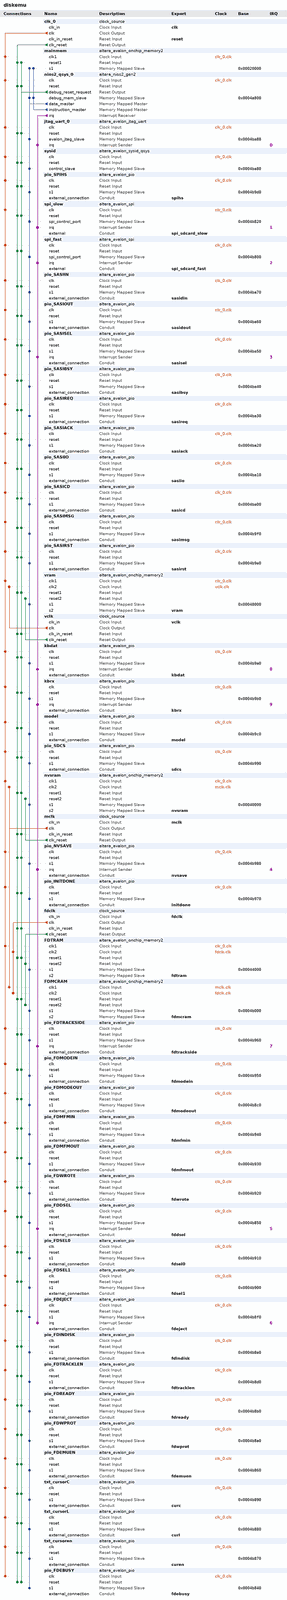
[diagram p0: system contents, whole]
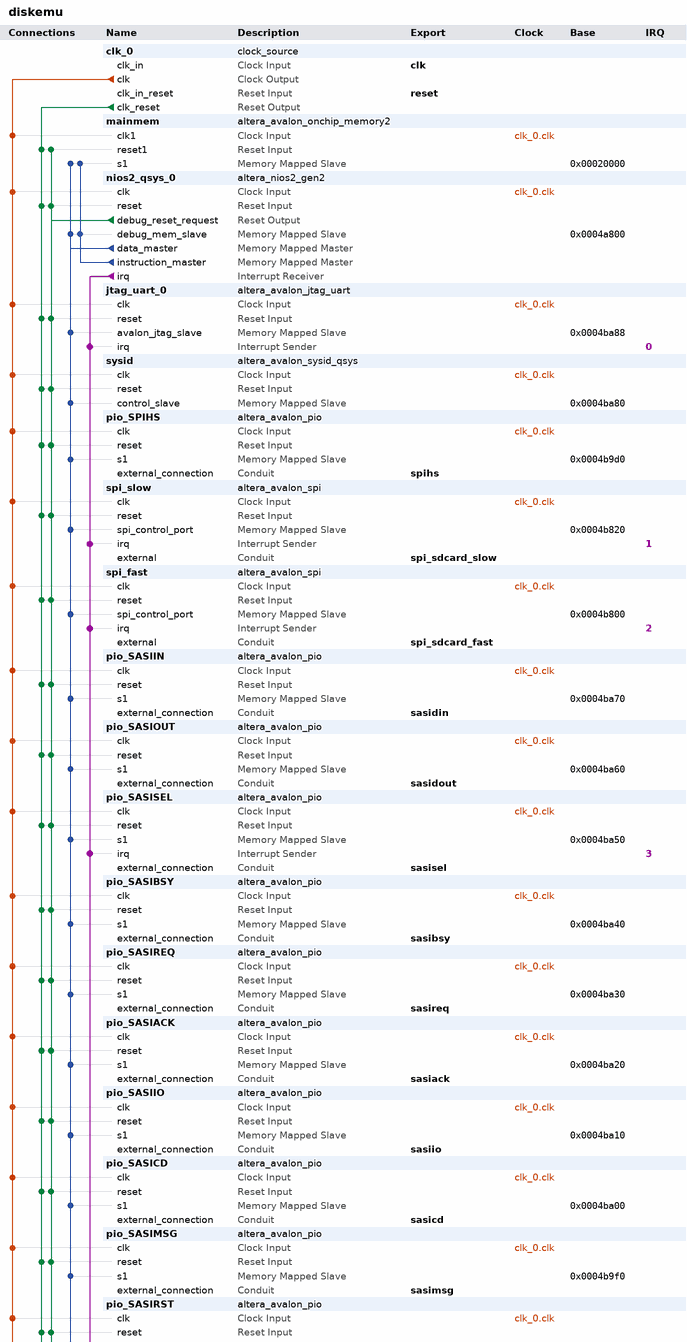
[diagram p1: system contents, upper part]
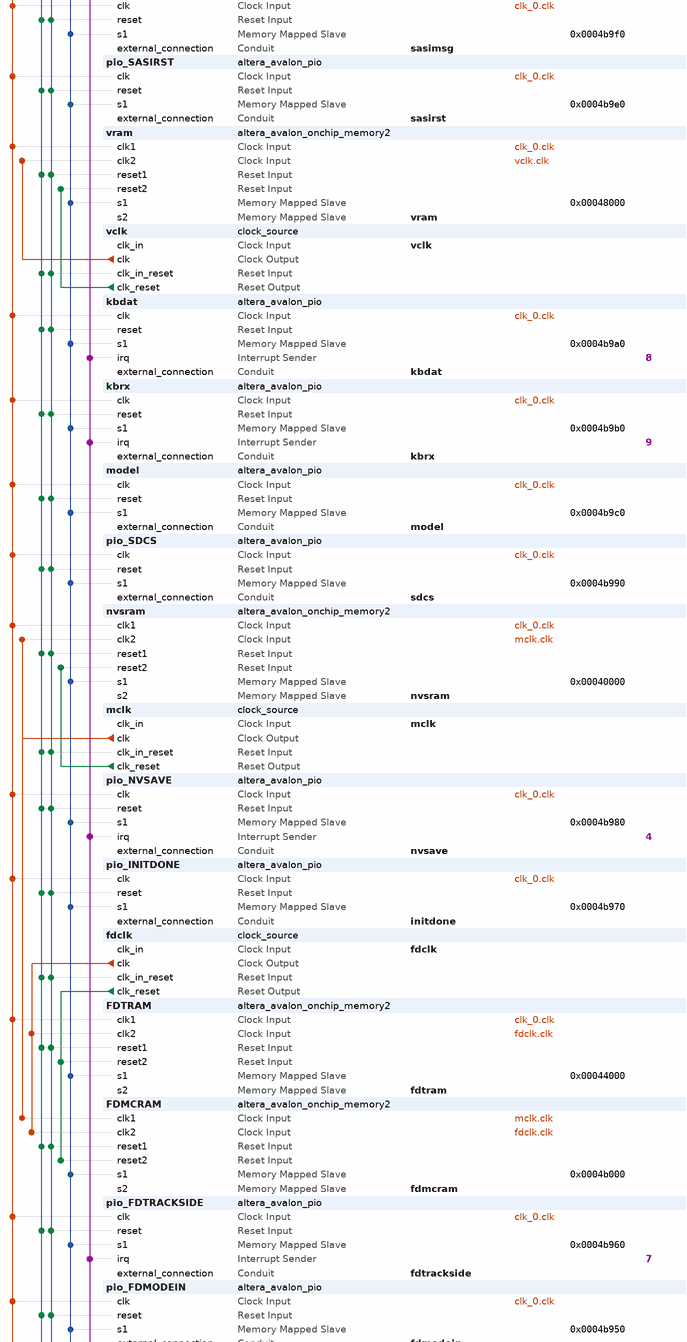
[diagram p2: system contents, middle part]
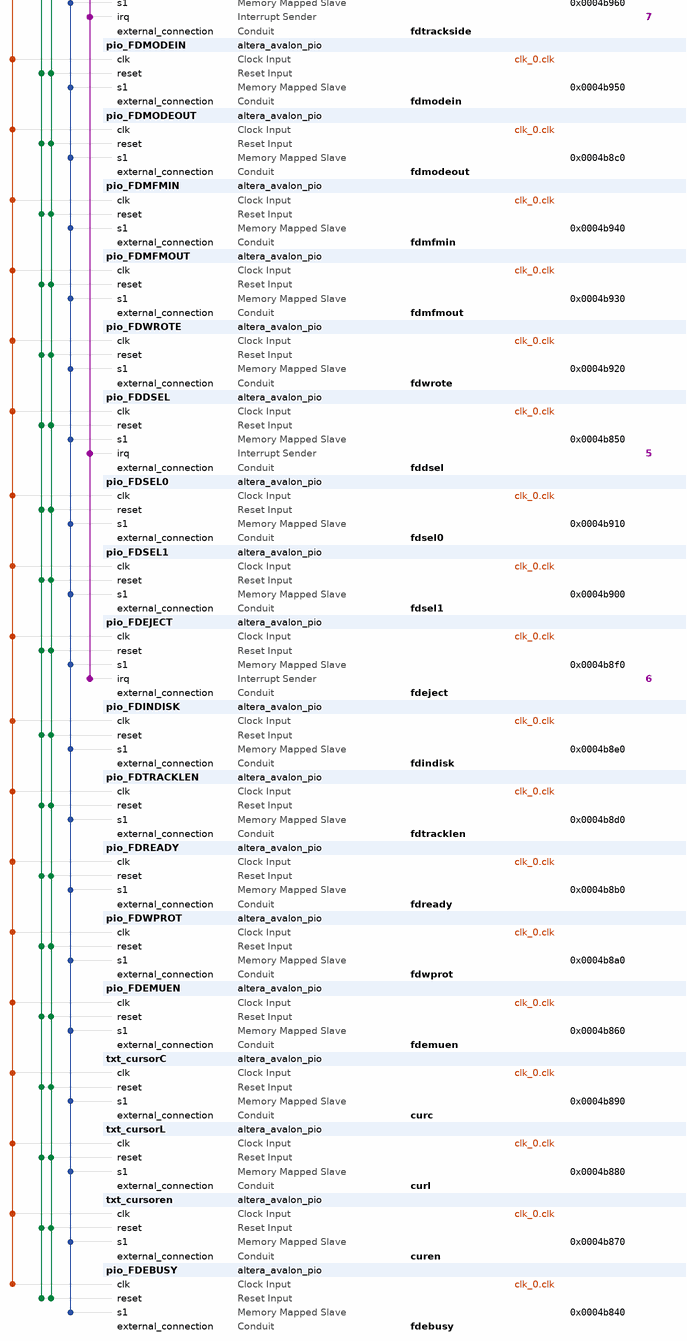
[diagram p3: system contents, lower part]
# Platform Designer (Qsys) system diskemu, Cyclone V 5CSEBA6U23I7
# Parameters at their usual value, and those the tool derives, are not listed.
package require -exact qsys 17.0
create_system diskemu
set_project_property DEVICE_FAMILY {Cyclone V}
set_project_property DEVICE 5CSEBA6U23I7

add_instance clk_0 clock_source 17.0
set_instance_parameter_value clk_0 clockFrequency 80000000

add_instance mainmem altera_avalon_onchip_memory2 17.0
set_instance_parameter_value mainmem dataWidth 32
set_instance_parameter_value mainmem dualPort false
set_instance_parameter_value mainmem initMemContent true
set_instance_parameter_value mainmem initializationFileName onchip_mem.hex
set_instance_parameter_value mainmem memorySize 98304

add_instance nios2_qsys_0 altera_nios2_gen2 17.0
set_instance_parameter_value nios2_qsys_0 dcache_size 2048
set_instance_parameter_value nios2_qsys_0 exceptionSlave mainmem.s1
set_instance_parameter_value nios2_qsys_0 icache_size 4096
set_instance_parameter_value nios2_qsys_0 impl Tiny
set_instance_parameter_value nios2_qsys_0 resetSlave mainmem.s1
set_instance_parameter_value nios2_qsys_0 setting_activateTrace true

add_instance jtag_uart_0 altera_avalon_jtag_uart 17.0
set_instance_parameter_value jtag_uart_0 simInteractiveOptions NO_INTERACTIVE_WINDOWS

add_instance sysid altera_avalon_sysid_qsys 17.0
set_instance_parameter_value sysid id 0

add_instance pio_SPIHS altera_avalon_pio 17.0
set_instance_parameter_value pio_SPIHS direction Output
set_instance_parameter_value pio_SPIHS width 1

add_instance spi_slow altera_avalon_spi 17.0
set_instance_parameter_value spi_slow clockPhase 1
set_instance_parameter_value spi_slow clockPolarity 1
set_instance_parameter_value spi_slow dataWidth 8
set_instance_parameter_value spi_slow masterSPI true
set_instance_parameter_value spi_slow numberOfSlaves 1
set_instance_parameter_value spi_slow targetClockRate 128000

add_instance spi_fast altera_avalon_spi 17.0
set_instance_parameter_value spi_fast clockPhase 1
set_instance_parameter_value spi_fast clockPolarity 1
set_instance_parameter_value spi_fast dataWidth 8
set_instance_parameter_value spi_fast masterSPI true
set_instance_parameter_value spi_fast numberOfSlaves 1
set_instance_parameter_value spi_fast targetClockRate 10000000

add_instance pio_SASIIN altera_avalon_pio 17.0
set_instance_parameter_value pio_SASIIN captureEdge true
set_instance_parameter_value pio_SASIIN direction Input
set_instance_parameter_value pio_SASIIN width 8

add_instance pio_SASIOUT altera_avalon_pio 17.0
set_instance_parameter_value pio_SASIOUT direction Output
set_instance_parameter_value pio_SASIOUT width 8

add_instance pio_SASISEL altera_avalon_pio 17.0
set_instance_parameter_value pio_SASISEL captureEdge true
set_instance_parameter_value pio_SASISEL direction Input
set_instance_parameter_value pio_SASISEL generateIRQ true
set_instance_parameter_value pio_SASISEL width 1

add_instance pio_SASIBSY altera_avalon_pio 17.0
set_instance_parameter_value pio_SASIBSY direction Output
set_instance_parameter_value pio_SASIBSY width 1

add_instance pio_SASIREQ altera_avalon_pio 17.0
set_instance_parameter_value pio_SASIREQ direction Output
set_instance_parameter_value pio_SASIREQ width 1

add_instance pio_SASIACK altera_avalon_pio 17.0
set_instance_parameter_value pio_SASIACK captureEdge true
set_instance_parameter_value pio_SASIACK direction Input
set_instance_parameter_value pio_SASIACK width 1

add_instance pio_SASIIO altera_avalon_pio 17.0
set_instance_parameter_value pio_SASIIO direction Output
set_instance_parameter_value pio_SASIIO width 1

add_instance pio_SASICD altera_avalon_pio 17.0
set_instance_parameter_value pio_SASICD captureEdge true
set_instance_parameter_value pio_SASICD direction Output
set_instance_parameter_value pio_SASICD width 1

add_instance pio_SASIMSG altera_avalon_pio 17.0
set_instance_parameter_value pio_SASIMSG direction Output
set_instance_parameter_value pio_SASIMSG width 1

add_instance pio_SASIRST altera_avalon_pio 17.0
set_instance_parameter_value pio_SASIRST captureEdge true
set_instance_parameter_value pio_SASIRST direction Input
set_instance_parameter_value pio_SASIRST width 1

add_instance vram altera_avalon_onchip_memory2 17.0
set_instance_parameter_value vram dataWidth 8
set_instance_parameter_value vram dualPort true
set_instance_parameter_value vram initMemContent true
set_instance_parameter_value vram initializationFileName onchip_mem.hex
set_instance_parameter_value vram memorySize 8192

add_instance vclk clock_source 17.0
set_instance_parameter_value vclk clockFrequency 80000000

add_instance kbdat altera_avalon_pio 17.0
set_instance_parameter_value kbdat captureEdge true
set_instance_parameter_value kbdat direction Input
set_instance_parameter_value kbdat generateIRQ true
set_instance_parameter_value kbdat irqType EDGE
set_instance_parameter_value kbdat width 8

add_instance kbrx altera_avalon_pio 17.0
set_instance_parameter_value kbrx captureEdge true
set_instance_parameter_value kbrx direction Input
set_instance_parameter_value kbrx generateIRQ true
set_instance_parameter_value kbrx irqType EDGE
set_instance_parameter_value kbrx width 1

add_instance model altera_avalon_pio 17.0
set_instance_parameter_value model direction Input
set_instance_parameter_value model width 8

add_instance pio_SDCS altera_avalon_pio 17.0
set_instance_parameter_value pio_SDCS direction Output
set_instance_parameter_value pio_SDCS resetValue 1
set_instance_parameter_value pio_SDCS width 1

add_instance nvsram altera_avalon_onchip_memory2 17.0
set_instance_parameter_value nvsram dataWidth 16
set_instance_parameter_value nvsram dualPort true
set_instance_parameter_value nvsram initMemContent true
set_instance_parameter_value nvsram initializationFileName onchip_mem.hex
set_instance_parameter_value nvsram memorySize 16384

add_instance mclk clock_source 17.0
set_instance_parameter_value mclk clockFrequency 10000000

add_instance pio_NVSAVE altera_avalon_pio 17.0
set_instance_parameter_value pio_NVSAVE captureEdge true
set_instance_parameter_value pio_NVSAVE direction Input
set_instance_parameter_value pio_NVSAVE generateIRQ true
set_instance_parameter_value pio_NVSAVE irqType EDGE
set_instance_parameter_value pio_NVSAVE width 1

add_instance pio_INITDONE altera_avalon_pio 17.0
set_instance_parameter_value pio_INITDONE direction Output
set_instance_parameter_value pio_INITDONE width 1

add_instance fdclk clock_source 17.0
set_instance_parameter_value fdclk clockFrequency 40000000

add_instance FDTRAM altera_avalon_onchip_memory2 17.0
set_instance_parameter_value FDTRAM dataWidth 8
set_instance_parameter_value FDTRAM dualPort true
set_instance_parameter_value FDTRAM initMemContent true
set_instance_parameter_value FDTRAM initializationFileName onchip_mem.hex
set_instance_parameter_value FDTRAM memorySize 12500

add_instance FDMCRAM altera_avalon_onchip_memory2 17.0
set_instance_parameter_value FDMCRAM dataWidth 8
set_instance_parameter_value FDMCRAM dualPort true
set_instance_parameter_value FDMCRAM initMemContent false
set_instance_parameter_value FDMCRAM initializationFileName onchip_mem.hex
set_instance_parameter_value FDMCRAM memorySize 1792

add_instance pio_FDTRACKSIDE altera_avalon_pio 17.0
set_instance_parameter_value pio_FDTRACKSIDE captureEdge true
set_instance_parameter_value pio_FDTRACKSIDE direction Input
set_instance_parameter_value pio_FDTRACKSIDE edgeType ANY
set_instance_parameter_value pio_FDTRACKSIDE generateIRQ true
set_instance_parameter_value pio_FDTRACKSIDE irqType EDGE
set_instance_parameter_value pio_FDTRACKSIDE width 8

add_instance pio_FDMODEIN altera_avalon_pio 17.0
set_instance_parameter_value pio_FDMODEIN direction Input
set_instance_parameter_value pio_FDMODEIN width 2

add_instance pio_FDMODEOUT altera_avalon_pio 17.0
set_instance_parameter_value pio_FDMODEOUT direction Output
set_instance_parameter_value pio_FDMODEOUT width 2

add_instance pio_FDMFMIN altera_avalon_pio 17.0
set_instance_parameter_value pio_FDMFMIN direction Input
set_instance_parameter_value pio_FDMFMIN width 1

add_instance pio_FDMFMOUT altera_avalon_pio 17.0
set_instance_parameter_value pio_FDMFMOUT direction Output
set_instance_parameter_value pio_FDMFMOUT width 1

add_instance pio_FDWROTE altera_avalon_pio 17.0
set_instance_parameter_value pio_FDWROTE captureEdge true
set_instance_parameter_value pio_FDWROTE direction Input
set_instance_parameter_value pio_FDWROTE width 1

add_instance pio_FDDSEL altera_avalon_pio 17.0
set_instance_parameter_value pio_FDDSEL captureEdge true
set_instance_parameter_value pio_FDDSEL direction Input
set_instance_parameter_value pio_FDDSEL edgeType ANY
set_instance_parameter_value pio_FDDSEL generateIRQ true
set_instance_parameter_value pio_FDDSEL irqType EDGE
set_instance_parameter_value pio_FDDSEL width 4

add_instance pio_FDSEL0 altera_avalon_pio 17.0
set_instance_parameter_value pio_FDSEL0 direction Output
set_instance_parameter_value pio_FDSEL0 resetValue 1
set_instance_parameter_value pio_FDSEL0 width 4

add_instance pio_FDSEL1 altera_avalon_pio 17.0
set_instance_parameter_value pio_FDSEL1 direction Output
set_instance_parameter_value pio_FDSEL1 resetValue 2
set_instance_parameter_value pio_FDSEL1 width 4

add_instance pio_FDEJECT altera_avalon_pio 17.0
set_instance_parameter_value pio_FDEJECT captureEdge true
set_instance_parameter_value pio_FDEJECT direction Input
set_instance_parameter_value pio_FDEJECT generateIRQ true
set_instance_parameter_value pio_FDEJECT irqType EDGE
set_instance_parameter_value pio_FDEJECT width 4

add_instance pio_FDINDISK altera_avalon_pio 17.0
set_instance_parameter_value pio_FDINDISK direction Output
set_instance_parameter_value pio_FDINDISK width 4

add_instance pio_FDTRACKLEN altera_avalon_pio 17.0
set_instance_parameter_value pio_FDTRACKLEN direction Output
set_instance_parameter_value pio_FDTRACKLEN width 14

add_instance pio_FDREADY altera_avalon_pio 17.0
set_instance_parameter_value pio_FDREADY direction Output
set_instance_parameter_value pio_FDREADY width 1

add_instance pio_FDWPROT altera_avalon_pio 17.0
set_instance_parameter_value pio_FDWPROT direction Output
set_instance_parameter_value pio_FDWPROT width 1

add_instance pio_FDEMUEN altera_avalon_pio 17.0
set_instance_parameter_value pio_FDEMUEN direction Output
set_instance_parameter_value pio_FDEMUEN width 4

add_instance txt_cursorC altera_avalon_pio 17.0
set_instance_parameter_value txt_cursorC direction Output
set_instance_parameter_value txt_cursorC width 7

add_instance txt_cursorL altera_avalon_pio 17.0
set_instance_parameter_value txt_cursorL direction Output
set_instance_parameter_value txt_cursorL width 6

add_instance txt_cursoren altera_avalon_pio 17.0
set_instance_parameter_value txt_cursoren direction Output
set_instance_parameter_value txt_cursoren width 1

add_instance pio_FDEBUSY altera_avalon_pio 17.0
set_instance_parameter_value pio_FDEBUSY direction Output
set_instance_parameter_value pio_FDEBUSY width 1

# connections
add_connection clk_0.clk FDTRAM.clk1 clock
add_connection clk_0.clk jtag_uart_0.clk clock
add_connection clk_0.clk kbdat.clk clock
add_connection clk_0.clk kbrx.clk clock
add_connection clk_0.clk mainmem.clk1 clock
add_connection clk_0.clk model.clk clock
add_connection clk_0.clk nios2_qsys_0.clk clock
add_connection clk_0.clk nvsram.clk1 clock
add_connection clk_0.clk pio_FDDSEL.clk clock
add_connection clk_0.clk pio_FDEBUSY.clk clock
add_connection clk_0.clk pio_FDEJECT.clk clock
add_connection clk_0.clk pio_FDEMUEN.clk clock
add_connection clk_0.clk pio_FDINDISK.clk clock
add_connection clk_0.clk pio_FDMFMIN.clk clock
add_connection clk_0.clk pio_FDMFMOUT.clk clock
add_connection clk_0.clk pio_FDMODEIN.clk clock
add_connection clk_0.clk pio_FDMODEOUT.clk clock
add_connection clk_0.clk pio_FDREADY.clk clock
add_connection clk_0.clk pio_FDSEL0.clk clock
add_connection clk_0.clk pio_FDSEL1.clk clock
add_connection clk_0.clk pio_FDTRACKLEN.clk clock
add_connection clk_0.clk pio_FDTRACKSIDE.clk clock
add_connection clk_0.clk pio_FDWPROT.clk clock
add_connection clk_0.clk pio_FDWROTE.clk clock
add_connection clk_0.clk pio_INITDONE.clk clock
add_connection clk_0.clk pio_NVSAVE.clk clock
add_connection clk_0.clk pio_SASIACK.clk clock
add_connection clk_0.clk pio_SASIBSY.clk clock
add_connection clk_0.clk pio_SASICD.clk clock
add_connection clk_0.clk pio_SASIIN.clk clock
add_connection clk_0.clk pio_SASIIO.clk clock
add_connection clk_0.clk pio_SASIMSG.clk clock
add_connection clk_0.clk pio_SASIOUT.clk clock
add_connection clk_0.clk pio_SASIREQ.clk clock
add_connection clk_0.clk pio_SASIRST.clk clock
add_connection clk_0.clk pio_SASISEL.clk clock
add_connection clk_0.clk pio_SDCS.clk clock
add_connection clk_0.clk pio_SPIHS.clk clock
add_connection clk_0.clk spi_fast.clk clock
add_connection clk_0.clk spi_slow.clk clock
add_connection clk_0.clk sysid.clk clock
add_connection clk_0.clk txt_cursorC.clk clock
add_connection clk_0.clk txt_cursoren.clk clock
add_connection clk_0.clk txt_cursorL.clk clock
add_connection clk_0.clk vram.clk1 clock
add_connection fdclk.clk FDMCRAM.clk2 clock
add_connection fdclk.clk FDTRAM.clk2 clock
add_connection mclk.clk FDMCRAM.clk1 clock
add_connection mclk.clk nvsram.clk2 clock
add_connection vclk.clk vram.clk2 clock
add_connection clk_0.clk_reset fdclk.clk_in_reset reset
add_connection clk_0.clk_reset FDMCRAM.reset1 reset
add_connection clk_0.clk_reset FDTRAM.reset1 reset
add_connection clk_0.clk_reset jtag_uart_0.reset reset
add_connection clk_0.clk_reset kbdat.reset reset
add_connection clk_0.clk_reset kbrx.reset reset
add_connection clk_0.clk_reset mainmem.reset1 reset
add_connection clk_0.clk_reset mclk.clk_in_reset reset
add_connection clk_0.clk_reset model.reset reset
add_connection clk_0.clk_reset nios2_qsys_0.reset reset
add_connection clk_0.clk_reset nvsram.reset1 reset
add_connection clk_0.clk_reset pio_FDDSEL.reset reset
add_connection clk_0.clk_reset pio_FDEBUSY.reset reset
add_connection clk_0.clk_reset pio_FDEJECT.reset reset
add_connection clk_0.clk_reset pio_FDEMUEN.reset reset
add_connection clk_0.clk_reset pio_FDINDISK.reset reset
add_connection clk_0.clk_reset pio_FDMFMIN.reset reset
add_connection clk_0.clk_reset pio_FDMFMOUT.reset reset
add_connection clk_0.clk_reset pio_FDMODEIN.reset reset
add_connection clk_0.clk_reset pio_FDMODEOUT.reset reset
add_connection clk_0.clk_reset pio_FDREADY.reset reset
add_connection clk_0.clk_reset pio_FDSEL0.reset reset
add_connection clk_0.clk_reset pio_FDSEL1.reset reset
add_connection clk_0.clk_reset pio_FDTRACKLEN.reset reset
add_connection clk_0.clk_reset pio_FDTRACKSIDE.reset reset
add_connection clk_0.clk_reset pio_FDWPROT.reset reset
add_connection clk_0.clk_reset pio_FDWROTE.reset reset
add_connection clk_0.clk_reset pio_INITDONE.reset reset
add_connection clk_0.clk_reset pio_NVSAVE.reset reset
add_connection clk_0.clk_reset pio_SASIACK.reset reset
add_connection clk_0.clk_reset pio_SASIBSY.reset reset
add_connection clk_0.clk_reset pio_SASICD.reset reset
add_connection clk_0.clk_reset pio_SASIIN.reset reset
add_connection clk_0.clk_reset pio_SASIIO.reset reset
add_connection clk_0.clk_reset pio_SASIMSG.reset reset
add_connection clk_0.clk_reset pio_SASIOUT.reset reset
add_connection clk_0.clk_reset pio_SASIREQ.reset reset
add_connection clk_0.clk_reset pio_SASIRST.reset reset
add_connection clk_0.clk_reset pio_SASISEL.reset reset
add_connection clk_0.clk_reset pio_SDCS.reset reset
add_connection clk_0.clk_reset pio_SPIHS.reset reset
add_connection clk_0.clk_reset spi_fast.reset reset
add_connection clk_0.clk_reset spi_slow.reset reset
add_connection clk_0.clk_reset sysid.reset reset
add_connection clk_0.clk_reset txt_cursorC.reset reset
add_connection clk_0.clk_reset txt_cursoren.reset reset
add_connection clk_0.clk_reset txt_cursorL.reset reset
add_connection clk_0.clk_reset vclk.clk_in_reset reset
add_connection clk_0.clk_reset vram.reset1 reset
add_connection fdclk.clk_reset FDMCRAM.reset2 reset
add_connection fdclk.clk_reset FDTRAM.reset2 reset
add_connection mclk.clk_reset nvsram.reset2 reset
add_connection nios2_qsys_0.debug_reset_request fdclk.clk_in_reset reset
add_connection nios2_qsys_0.debug_reset_request FDMCRAM.reset1 reset
add_connection nios2_qsys_0.debug_reset_request FDTRAM.reset1 reset
add_connection nios2_qsys_0.debug_reset_request jtag_uart_0.reset reset
add_connection nios2_qsys_0.debug_reset_request kbdat.reset reset
add_connection nios2_qsys_0.debug_reset_request kbrx.reset reset
add_connection nios2_qsys_0.debug_reset_request mainmem.reset1 reset
add_connection nios2_qsys_0.debug_reset_request mclk.clk_in_reset reset
add_connection nios2_qsys_0.debug_reset_request model.reset reset
add_connection nios2_qsys_0.debug_reset_request nios2_qsys_0.reset reset
add_connection nios2_qsys_0.debug_reset_request nvsram.reset1 reset
add_connection nios2_qsys_0.debug_reset_request pio_FDDSEL.reset reset
add_connection nios2_qsys_0.debug_reset_request pio_FDEBUSY.reset reset
add_connection nios2_qsys_0.debug_reset_request pio_FDEJECT.reset reset
add_connection nios2_qsys_0.debug_reset_request pio_FDEMUEN.reset reset
add_connection nios2_qsys_0.debug_reset_request pio_FDINDISK.reset reset
add_connection nios2_qsys_0.debug_reset_request pio_FDMFMIN.reset reset
add_connection nios2_qsys_0.debug_reset_request pio_FDMFMOUT.reset reset
add_connection nios2_qsys_0.debug_reset_request pio_FDMODEIN.reset reset
add_connection nios2_qsys_0.debug_reset_request pio_FDMODEOUT.reset reset
add_connection nios2_qsys_0.debug_reset_request pio_FDREADY.reset reset
add_connection nios2_qsys_0.debug_reset_request pio_FDSEL0.reset reset
add_connection nios2_qsys_0.debug_reset_request pio_FDSEL1.reset reset
add_connection nios2_qsys_0.debug_reset_request pio_FDTRACKLEN.reset reset
add_connection nios2_qsys_0.debug_reset_request pio_FDTRACKSIDE.reset reset
add_connection nios2_qsys_0.debug_reset_request pio_FDWPROT.reset reset
add_connection nios2_qsys_0.debug_reset_request pio_FDWROTE.reset reset
add_connection nios2_qsys_0.debug_reset_request pio_INITDONE.reset reset
add_connection nios2_qsys_0.debug_reset_request pio_NVSAVE.reset reset
add_connection nios2_qsys_0.debug_reset_request pio_SASIACK.reset reset
add_connection nios2_qsys_0.debug_reset_request pio_SASIBSY.reset reset
add_connection nios2_qsys_0.debug_reset_request pio_SASICD.reset reset
add_connection nios2_qsys_0.debug_reset_request pio_SASIIN.reset reset
add_connection nios2_qsys_0.debug_reset_request pio_SASIIO.reset reset
add_connection nios2_qsys_0.debug_reset_request pio_SASIMSG.reset reset
add_connection nios2_qsys_0.debug_reset_request pio_SASIOUT.reset reset
add_connection nios2_qsys_0.debug_reset_request pio_SASIREQ.reset reset
add_connection nios2_qsys_0.debug_reset_request pio_SASIRST.reset reset
add_connection nios2_qsys_0.debug_reset_request pio_SASISEL.reset reset
add_connection nios2_qsys_0.debug_reset_request pio_SDCS.reset reset
add_connection nios2_qsys_0.debug_reset_request pio_SPIHS.reset reset
add_connection nios2_qsys_0.debug_reset_request spi_fast.reset reset
add_connection nios2_qsys_0.debug_reset_request spi_slow.reset reset
add_connection nios2_qsys_0.debug_reset_request sysid.reset reset
add_connection nios2_qsys_0.debug_reset_request txt_cursorC.reset reset
add_connection nios2_qsys_0.debug_reset_request txt_cursoren.reset reset
add_connection nios2_qsys_0.debug_reset_request txt_cursorL.reset reset
add_connection nios2_qsys_0.debug_reset_request vclk.clk_in_reset reset
add_connection nios2_qsys_0.debug_reset_request vram.reset1 reset
add_connection vclk.clk_reset vram.reset2 reset
add_connection nios2_qsys_0.data_master FDMCRAM.s1 avalon
set_connection_parameter_value nios2_qsys_0.data_master/FDMCRAM.s1 baseAddress 0x0004b000
add_connection nios2_qsys_0.data_master FDTRAM.s1 avalon
set_connection_parameter_value nios2_qsys_0.data_master/FDTRAM.s1 baseAddress 0x00044000
add_connection nios2_qsys_0.data_master jtag_uart_0.avalon_jtag_slave avalon
set_connection_parameter_value nios2_qsys_0.data_master/jtag_uart_0.avalon_jtag_slave baseAddress 0x0004ba88
add_connection nios2_qsys_0.data_master kbdat.s1 avalon
set_connection_parameter_value nios2_qsys_0.data_master/kbdat.s1 baseAddress 0x0004b9a0
add_connection nios2_qsys_0.data_master kbrx.s1 avalon
set_connection_parameter_value nios2_qsys_0.data_master/kbrx.s1 baseAddress 0x0004b9b0
add_connection nios2_qsys_0.data_master mainmem.s1 avalon
set_connection_parameter_value nios2_qsys_0.data_master/mainmem.s1 baseAddress 0x00020000
add_connection nios2_qsys_0.data_master model.s1 avalon
set_connection_parameter_value nios2_qsys_0.data_master/model.s1 baseAddress 0x0004b9c0
add_connection nios2_qsys_0.data_master nios2_qsys_0.debug_mem_slave avalon
set_connection_parameter_value nios2_qsys_0.data_master/nios2_qsys_0.debug_mem_slave baseAddress 0x0004a800
add_connection nios2_qsys_0.data_master nvsram.s1 avalon
set_connection_parameter_value nios2_qsys_0.data_master/nvsram.s1 baseAddress 0x00040000
add_connection nios2_qsys_0.data_master pio_FDDSEL.s1 avalon
set_connection_parameter_value nios2_qsys_0.data_master/pio_FDDSEL.s1 baseAddress 0x0004b850
add_connection nios2_qsys_0.data_master pio_FDEBUSY.s1 avalon
set_connection_parameter_value nios2_qsys_0.data_master/pio_FDEBUSY.s1 baseAddress 0x0004b840
add_connection nios2_qsys_0.data_master pio_FDEJECT.s1 avalon
set_connection_parameter_value nios2_qsys_0.data_master/pio_FDEJECT.s1 baseAddress 0x0004b8f0
add_connection nios2_qsys_0.data_master pio_FDEMUEN.s1 avalon
set_connection_parameter_value nios2_qsys_0.data_master/pio_FDEMUEN.s1 baseAddress 0x0004b860
add_connection nios2_qsys_0.data_master pio_FDINDISK.s1 avalon
set_connection_parameter_value nios2_qsys_0.data_master/pio_FDINDISK.s1 baseAddress 0x0004b8e0
add_connection nios2_qsys_0.data_master pio_FDMFMIN.s1 avalon
set_connection_parameter_value nios2_qsys_0.data_master/pio_FDMFMIN.s1 baseAddress 0x0004b940
add_connection nios2_qsys_0.data_master pio_FDMFMOUT.s1 avalon
set_connection_parameter_value nios2_qsys_0.data_master/pio_FDMFMOUT.s1 baseAddress 0x0004b930
add_connection nios2_qsys_0.data_master pio_FDMODEIN.s1 avalon
set_connection_parameter_value nios2_qsys_0.data_master/pio_FDMODEIN.s1 baseAddress 0x0004b950
add_connection nios2_qsys_0.data_master pio_FDMODEOUT.s1 avalon
set_connection_parameter_value nios2_qsys_0.data_master/pio_FDMODEOUT.s1 baseAddress 0x0004b8c0
add_connection nios2_qsys_0.data_master pio_FDREADY.s1 avalon
set_connection_parameter_value nios2_qsys_0.data_master/pio_FDREADY.s1 baseAddress 0x0004b8b0
add_connection nios2_qsys_0.data_master pio_FDSEL0.s1 avalon
set_connection_parameter_value nios2_qsys_0.data_master/pio_FDSEL0.s1 baseAddress 0x0004b910
add_connection nios2_qsys_0.data_master pio_FDSEL1.s1 avalon
set_connection_parameter_value nios2_qsys_0.data_master/pio_FDSEL1.s1 baseAddress 0x0004b900
add_connection nios2_qsys_0.data_master pio_FDTRACKLEN.s1 avalon
set_connection_parameter_value nios2_qsys_0.data_master/pio_FDTRACKLEN.s1 baseAddress 0x0004b8d0
add_connection nios2_qsys_0.data_master pio_FDTRACKSIDE.s1 avalon
set_connection_parameter_value nios2_qsys_0.data_master/pio_FDTRACKSIDE.s1 baseAddress 0x0004b960
add_connection nios2_qsys_0.data_master pio_FDWPROT.s1 avalon
set_connection_parameter_value nios2_qsys_0.data_master/pio_FDWPROT.s1 baseAddress 0x0004b8a0
add_connection nios2_qsys_0.data_master pio_FDWROTE.s1 avalon
set_connection_parameter_value nios2_qsys_0.data_master/pio_FDWROTE.s1 baseAddress 0x0004b920
add_connection nios2_qsys_0.data_master pio_INITDONE.s1 avalon
set_connection_parameter_value nios2_qsys_0.data_master/pio_INITDONE.s1 baseAddress 0x0004b970
add_connection nios2_qsys_0.data_master pio_NVSAVE.s1 avalon
set_connection_parameter_value nios2_qsys_0.data_master/pio_NVSAVE.s1 baseAddress 0x0004b980
add_connection nios2_qsys_0.data_master pio_SASIACK.s1 avalon
set_connection_parameter_value nios2_qsys_0.data_master/pio_SASIACK.s1 baseAddress 0x0004ba20
add_connection nios2_qsys_0.data_master pio_SASIBSY.s1 avalon
set_connection_parameter_value nios2_qsys_0.data_master/pio_SASIBSY.s1 baseAddress 0x0004ba40
add_connection nios2_qsys_0.data_master pio_SASICD.s1 avalon
set_connection_parameter_value nios2_qsys_0.data_master/pio_SASICD.s1 baseAddress 0x0004ba00
add_connection nios2_qsys_0.data_master pio_SASIIN.s1 avalon
set_connection_parameter_value nios2_qsys_0.data_master/pio_SASIIN.s1 baseAddress 0x0004ba70
add_connection nios2_qsys_0.data_master pio_SASIIO.s1 avalon
set_connection_parameter_value nios2_qsys_0.data_master/pio_SASIIO.s1 baseAddress 0x0004ba10
add_connection nios2_qsys_0.data_master pio_SASIMSG.s1 avalon
set_connection_parameter_value nios2_qsys_0.data_master/pio_SASIMSG.s1 baseAddress 0x0004b9f0
add_connection nios2_qsys_0.data_master pio_SASIOUT.s1 avalon
set_connection_parameter_value nios2_qsys_0.data_master/pio_SASIOUT.s1 baseAddress 0x0004ba60
add_connection nios2_qsys_0.data_master pio_SASIREQ.s1 avalon
set_connection_parameter_value nios2_qsys_0.data_master/pio_SASIREQ.s1 baseAddress 0x0004ba30
add_connection nios2_qsys_0.data_master pio_SASIRST.s1 avalon
set_connection_parameter_value nios2_qsys_0.data_master/pio_SASIRST.s1 baseAddress 0x0004b9e0
add_connection nios2_qsys_0.data_master pio_SASISEL.s1 avalon
set_connection_parameter_value nios2_qsys_0.data_master/pio_SASISEL.s1 baseAddress 0x0004ba50
add_connection nios2_qsys_0.data_master pio_SDCS.s1 avalon
set_connection_parameter_value nios2_qsys_0.data_master/pio_SDCS.s1 baseAddress 0x0004b990
add_connection nios2_qsys_0.data_master pio_SPIHS.s1 avalon
set_connection_parameter_value nios2_qsys_0.data_master/pio_SPIHS.s1 baseAddress 0x0004b9d0
add_connection nios2_qsys_0.data_master spi_fast.spi_control_port avalon
set_connection_parameter_value nios2_qsys_0.data_master/spi_fast.spi_control_port baseAddress 0x0004b800
add_connection nios2_qsys_0.data_master spi_slow.spi_control_port avalon
set_connection_parameter_value nios2_qsys_0.data_master/spi_slow.spi_control_port baseAddress 0x0004b820
add_connection nios2_qsys_0.data_master sysid.control_slave avalon
set_connection_parameter_value nios2_qsys_0.data_master/sysid.control_slave baseAddress 0x0004ba80
add_connection nios2_qsys_0.data_master txt_cursorC.s1 avalon
set_connection_parameter_value nios2_qsys_0.data_master/txt_cursorC.s1 baseAddress 0x0004b890
add_connection nios2_qsys_0.data_master txt_cursoren.s1 avalon
set_connection_parameter_value nios2_qsys_0.data_master/txt_cursoren.s1 baseAddress 0x0004b870
add_connection nios2_qsys_0.data_master txt_cursorL.s1 avalon
set_connection_parameter_value nios2_qsys_0.data_master/txt_cursorL.s1 baseAddress 0x0004b880
add_connection nios2_qsys_0.data_master vram.s1 avalon
set_connection_parameter_value nios2_qsys_0.data_master/vram.s1 baseAddress 0x00048000
add_connection nios2_qsys_0.instruction_master mainmem.s1 avalon
set_connection_parameter_value nios2_qsys_0.instruction_master/mainmem.s1 baseAddress 0x00020000
add_connection nios2_qsys_0.instruction_master nios2_qsys_0.debug_mem_slave avalon
set_connection_parameter_value nios2_qsys_0.instruction_master/nios2_qsys_0.debug_mem_slave baseAddress 0x0004a800
add_connection nios2_qsys_0.irq jtag_uart_0.irq interrupt
set_connection_parameter_value nios2_qsys_0.irq/jtag_uart_0.irq irqNumber 0
add_connection nios2_qsys_0.irq kbdat.irq interrupt
set_connection_parameter_value nios2_qsys_0.irq/kbdat.irq irqNumber 8
add_connection nios2_qsys_0.irq kbrx.irq interrupt
set_connection_parameter_value nios2_qsys_0.irq/kbrx.irq irqNumber 9
add_connection nios2_qsys_0.irq pio_FDDSEL.irq interrupt
set_connection_parameter_value nios2_qsys_0.irq/pio_FDDSEL.irq irqNumber 5
add_connection nios2_qsys_0.irq pio_FDEJECT.irq interrupt
set_connection_parameter_value nios2_qsys_0.irq/pio_FDEJECT.irq irqNumber 6
add_connection nios2_qsys_0.irq pio_FDTRACKSIDE.irq interrupt
set_connection_parameter_value nios2_qsys_0.irq/pio_FDTRACKSIDE.irq irqNumber 7
add_connection nios2_qsys_0.irq pio_NVSAVE.irq interrupt
set_connection_parameter_value nios2_qsys_0.irq/pio_NVSAVE.irq irqNumber 4
add_connection nios2_qsys_0.irq pio_SASISEL.irq interrupt
set_connection_parameter_value nios2_qsys_0.irq/pio_SASISEL.irq irqNumber 3
add_connection nios2_qsys_0.irq spi_fast.irq interrupt
set_connection_parameter_value nios2_qsys_0.irq/spi_fast.irq irqNumber 2
add_connection nios2_qsys_0.irq spi_slow.irq interrupt
set_connection_parameter_value nios2_qsys_0.irq/spi_slow.irq irqNumber 1

# exported interfaces
add_interface clk clock sink
set_interface_property clk EXPORT_OF clk_0.clk_in
add_interface curc conduit end
set_interface_property curc EXPORT_OF txt_cursorC.external_connection
add_interface curen conduit end
set_interface_property curen EXPORT_OF txt_cursoren.external_connection
add_interface curl conduit end
set_interface_property curl EXPORT_OF txt_cursorL.external_connection
add_interface fdclk clock sink
set_interface_property fdclk EXPORT_OF fdclk.clk_in
add_interface fddsel conduit end
set_interface_property fddsel EXPORT_OF pio_FDDSEL.external_connection
add_interface fdebusy conduit end
set_interface_property fdebusy EXPORT_OF pio_FDEBUSY.external_connection
add_interface fdeject conduit end
set_interface_property fdeject EXPORT_OF pio_FDEJECT.external_connection
add_interface fdemuen conduit end
set_interface_property fdemuen EXPORT_OF pio_FDEMUEN.external_connection
add_interface fdindisk conduit end
set_interface_property fdindisk EXPORT_OF pio_FDINDISK.external_connection
add_interface fdmcram avalon slave
set_interface_property fdmcram EXPORT_OF FDMCRAM.s2
add_interface fdmfmin conduit end
set_interface_property fdmfmin EXPORT_OF pio_FDMFMIN.external_connection
add_interface fdmfmout conduit end
set_interface_property fdmfmout EXPORT_OF pio_FDMFMOUT.external_connection
add_interface fdmodein conduit end
set_interface_property fdmodein EXPORT_OF pio_FDMODEIN.external_connection
add_interface fdmodeout conduit end
set_interface_property fdmodeout EXPORT_OF pio_FDMODEOUT.external_connection
add_interface fdready conduit end
set_interface_property fdready EXPORT_OF pio_FDREADY.external_connection
add_interface fdsel0 conduit end
set_interface_property fdsel0 EXPORT_OF pio_FDSEL0.external_connection
add_interface fdsel1 conduit end
set_interface_property fdsel1 EXPORT_OF pio_FDSEL1.external_connection
add_interface fdtracklen conduit end
set_interface_property fdtracklen EXPORT_OF pio_FDTRACKLEN.external_connection
add_interface fdtrackside conduit end
set_interface_property fdtrackside EXPORT_OF pio_FDTRACKSIDE.external_connection
add_interface fdtram avalon slave
set_interface_property fdtram EXPORT_OF FDTRAM.s2
add_interface fdwprot conduit end
set_interface_property fdwprot EXPORT_OF pio_FDWPROT.external_connection
add_interface fdwrote conduit end
set_interface_property fdwrote EXPORT_OF pio_FDWROTE.external_connection
add_interface initdone conduit end
set_interface_property initdone EXPORT_OF pio_INITDONE.external_connection
add_interface kbdat conduit end
set_interface_property kbdat EXPORT_OF kbdat.external_connection
add_interface kbrx conduit end
set_interface_property kbrx EXPORT_OF kbrx.external_connection
add_interface mclk clock sink
set_interface_property mclk EXPORT_OF mclk.clk_in
add_interface model conduit end
set_interface_property model EXPORT_OF model.external_connection
add_interface nvsave conduit end
set_interface_property nvsave EXPORT_OF pio_NVSAVE.external_connection
add_interface nvsram avalon slave
set_interface_property nvsram EXPORT_OF nvsram.s2
add_interface reset reset sink
set_interface_property reset EXPORT_OF clk_0.clk_in_reset
add_interface sasiack conduit end
set_interface_property sasiack EXPORT_OF pio_SASIACK.external_connection
add_interface sasibsy conduit end
set_interface_property sasibsy EXPORT_OF pio_SASIBSY.external_connection
add_interface sasicd conduit end
set_interface_property sasicd EXPORT_OF pio_SASICD.external_connection
add_interface sasidin conduit end
set_interface_property sasidin EXPORT_OF pio_SASIIN.external_connection
add_interface sasidout conduit end
set_interface_property sasidout EXPORT_OF pio_SASIOUT.external_connection
add_interface sasiio conduit end
set_interface_property sasiio EXPORT_OF pio_SASIIO.external_connection
add_interface sasimsg conduit end
set_interface_property sasimsg EXPORT_OF pio_SASIMSG.external_connection
add_interface sasireq conduit end
set_interface_property sasireq EXPORT_OF pio_SASIREQ.external_connection
add_interface sasirst conduit end
set_interface_property sasirst EXPORT_OF pio_SASIRST.external_connection
add_interface sasisel conduit end
set_interface_property sasisel EXPORT_OF pio_SASISEL.external_connection
add_interface sdcs conduit end
set_interface_property sdcs EXPORT_OF pio_SDCS.external_connection
add_interface spi_sdcard_fast conduit end
set_interface_property spi_sdcard_fast EXPORT_OF spi_fast.external
add_interface spi_sdcard_slow conduit end
set_interface_property spi_sdcard_slow EXPORT_OF spi_slow.external
add_interface spihs conduit end
set_interface_property spihs EXPORT_OF pio_SPIHS.external_connection
add_interface vclk clock sink
set_interface_property vclk EXPORT_OF vclk.clk_in
add_interface vram avalon slave
set_interface_property vram EXPORT_OF vram.s2

set_interconnect_requirement {$system} qsys_mm.clockCrossingAdapter HANDSHAKE
set_interconnect_requirement {$system} qsys_mm.insertDefaultSlave false
set_interconnect_requirement {$system} qsys_mm.maxAdditionalLatency 1

save_system diskemu.qsys
